# EAGLE design RatDBS (EAGLE 7.3.0)
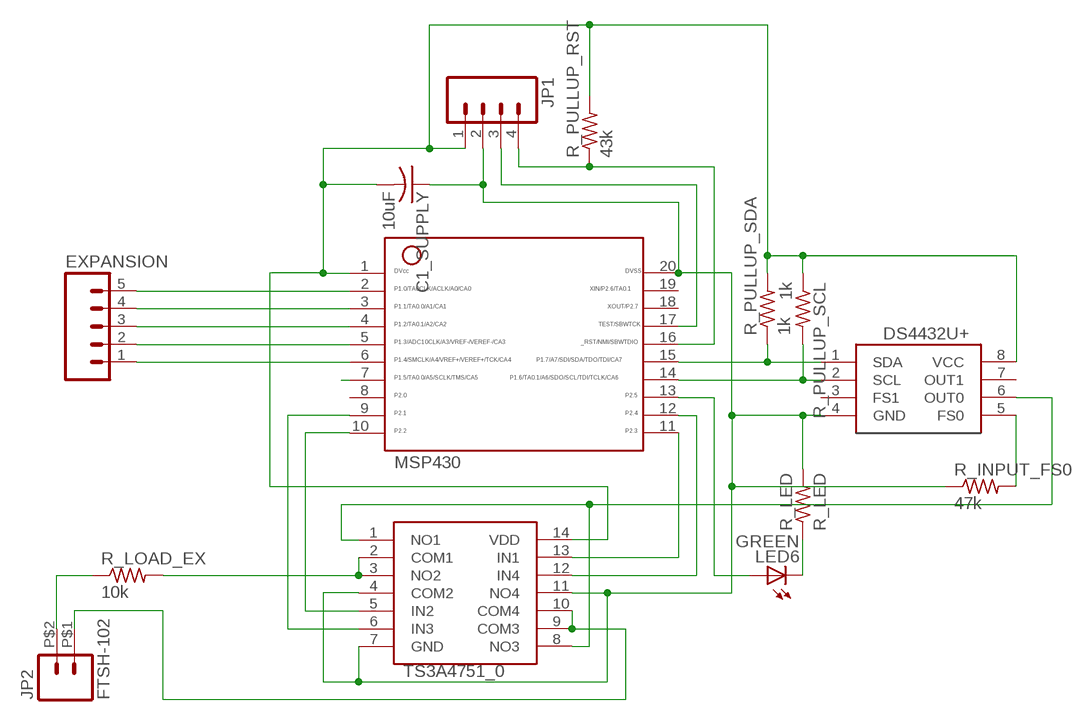
[diagram p0: schematic, sheet 1]

## Parts
C1_SUPPLY  10uF  C-USC0603  [C0603]
DS4432U+  DS4432U+  [8_PIN]
EXPANSION  M051.27MM  [1X05-1.27MM]
JP1  M041.27MM  [1X04-1.27MM]
JP2  FTSH-102  [FTSH-102-DH]
LED6  GREEN  LED1206  [LED-1206]
MSP430  MSP430  [20_PIN]
R_INPUT_FS0  47k  R-US_R0603  [R0603]
R_LED  R_LED  R-US_R0603  [R0603]
R_LOAD_EX  10k  R-US_R0603  [R0603]
R_PULLUP_RST  43k  R-US_R0603  [R0603]
R_PULLUP_SCL  1k  R-US_R0603  [R0603]
R_PULLUP_SDA  1k  R-US_R0603  [R0603]
TS3A4751_0  TS3A4751  [14_PIN]

## Nets
_RST: JP1.4 MSP430.16 R_PULLUP_RST.1
CURRENT0: DS4432U+.6(OUT0) TS3A4751_0.1(NO1) TS3A4751_0.8(NO3)
GND: C1_SUPPLY.1 DS4432U+.4(GND) JP1.2 MSP430.20 R_INPUT_FS0.1 R_LED.2 TS3A4751_0.4(COM2) TS3A4751_0.7(GND) TS3A4751_0.11(NO4)
IN1: MSP430.11 TS3A4751_0.13(IN1)
IN2_0: MSP430.10 TS3A4751_0.5(IN2)
IN3_0: MSP430.9 TS3A4751_0.6(IN3)
IN4: MSP430.12 TS3A4751_0.12(IN4)
LOAD1_0: R_LOAD_EX.2 TS3A4751_0.2(COM1) TS3A4751_0.3(NO2)
LOAD2_0: JP2.P$1 TS3A4751_0.9(COM3) TS3A4751_0.10(COM4)
N$1: DS4432U+.2(SCL) MSP430.14 R_PULLUP_SCL.2
N$2: DS4432U+.1(SDA) MSP430.15 R_PULLUP_SDA.1
N$3: EXPANSION.1 MSP430.6
N$4: JP2.P$2 R_LOAD_EX.1
N$5: LED6.A MSP430.13
N$6: MSP430.7
N$7: EXPANSION.2 MSP430.5
N$8: DS4432U+.5(FS0) R_INPUT_FS0.2
N$9: LED6.C R_LED.1
N$10: EXPANSION.3 MSP430.4
N$11: EXPANSION.4 MSP430.3
N$12: EXPANSION.5 MSP430.2
TEST: JP1.3 MSP430.17
VDD: C1_SUPPLY.2 DS4432U+.8(VCC) JP1.1 MSP430.1 R_PULLUP_RST.2 R_PULLUP_SCL.1 R_PULLUP_SDA.2 TS3A4751_0.14(VDD)
Unconnected: DS4432U+.3(FS1) DS4432U+.7(OUT1) MSP430.8 MSP430.18 MSP430.19

## Library data of the parts
C1_SUPPLY = resistor:C-US: CAPACITOR, American symbol
DS4432U+ = BiphasicBoard:DS4432U+: DS4432U+ current DAC
EXPANSION = SparkFun:M05: Header 5 Standard 5-pin 0.1" header. Use with straight break away headers (SKU : PRT-00116), right angle break away headers (PRT-00553), swiss pins (PRT-00743), machine pins (PRT-00117), and female headers (PRT-00115). Molex polarized connector foot print use with SKU : PRT-08230 with associated crimp pins and housings.
JP1 = SparkFun:M04: Header 4 Standard 4-pin 0.1" header. Use with straight break away headers (SKU : PRT-00116), right angle break away headers (PRT-00553), swiss pins (PRT-00743), machine pins (PRT-00117), and female headers (PRT-00115). Molex polarized connector foot print use with SKU : PRT-08231 with associated crimp pins and housings.
JP2 = Samtec50Mil:FTSH-102
LED6 = SparkFun-LED:LED: LEDs Standard schematic elements and footprints for 5mm, 3mm, 1206, and 0603 sized LEDs. 5mm - Spark Fun Electronics SKU : COM-00529 (and others)
MSP430 = BiphasicBoard:MSP430: MSP430 20 pins
R_INPUT_FS0 R_LED R_LOAD_EX R_PULLUP_RST R_PULLUP_SCL R_PULLUP_SDA = BiphasicBoard:R-US_: RESISTOR, American symbol
TS3A4751_0 = BiphasicBoard:TS3A4751: TS3A4751 Quad Switch

## Board
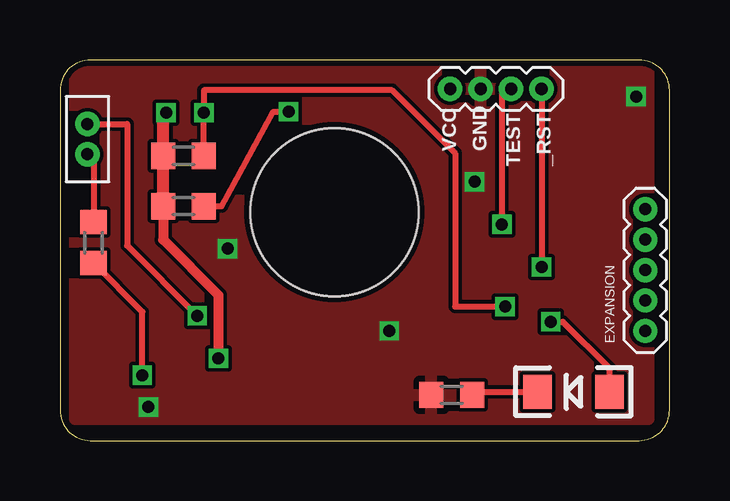
[diagram p1: board, top side]
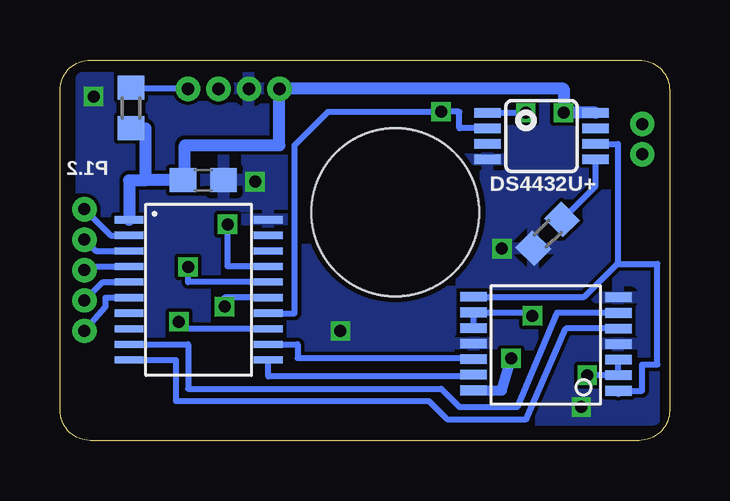
[diagram p2: board, bottom side, seen from below]

Size 25.4 x 15.88 mm. Coordinates in mm from the lower left corner, seen from the top.
Outline: 0,14.61 0,1.27 arc90 1.27,0 24.13,0 arc90 25.4,1.27 25.4,14.61 arc90 24.13,15.88 1.27,15.88 arc90 0,14.61
Copper layers (1*16): Top 0.035mm / dielectric 1.5mm / Bottom 0.035mm
Design rules "SeeedStudio_2layer_DRU_no_angle_20140221-1": minimum track width 6mil, minimum drill 12mil, track to track 6mil, track to pad 6mil, pad to pad 6mil, via to via 6mil, smd to smd 0mil, copper to edge 10mil, drill to drill 10mil, minimum pad ring 10mil, minimum via ring 6mil, stop-mask expansion 2mil, vias tented up to drill 100mil, thermal gap 10mil
Holes 7 mm at 11.43,9.53

### Footprints (pad centres in the part's own frame; a part is rotated, then mirrored left to right if it is on the bottom)
C0603 = smd 1.1 x 1: 1 -0.85,0; 2 0.85,0
8_PIN = smd 1.1 x 0.4: 1 -2.25,0.975; 2 -2.25,0.325; 3 -2.25,-0.325; 4 -2.25,-0.975; 5 2.25,-0.975; 6 2.25,-0.325; 7 2.25,0.325; 8 2.25,0.975
1X05-1.27MM = drill 0.508 pad 1: 1 0,0; 2 1.27,0; 3 2.54,0; 4 3.81,0; 5 5.08,0
1X04-1.27MM = drill 0.508 pad 1: 1 0,0; 2 1.27,0; 3 2.54,0; 4 3.81,0
FTSH-102-DH = drill 0.5 pad 1: P$1 -0.635,0; P$2 0.635,0
LED-1206 = smd 1.2 x 1.4: A -1.5,0; C 1.5,0
20_PIN = smd 0.3 x 1.2: 1 -2.925,-2.9; 2 -2.275,-2.9; 3 -1.625,-2.9; 4 -0.975,-2.9; 5 -0.325,-2.9; 6 0.325,-2.9; 7 0.975,-2.9; 8 1.625,-2.9; 9 2.275,-2.9; 10 2.925,-2.9; 11 2.925,2.9; 12 2.275,2.9; 13 1.625,2.9; 14 0.975,2.9; 15 0.325,2.9; 16 -0.325,2.9; 17 -0.975,2.9; 18 -1.625,2.9; 19 -2.275,2.9; 20 -2.925,2.9
R0603 = smd 1 x 1.1: 1 -0.85,0; 2 0.85,0
14_PIN = smd 1.1 x 0.4: 1 -3.26,1.165; 2 -3.26,0.515; 3 -3.26,-0.135; 4 -3.26,-0.785; 5 -3.26,-1.435; 6 -3.26,-2.085; 7 -3.26,-2.735; 8 2.77,-2.755; 9 2.77,-2.105; 10 2.77,-1.455; 11 2.77,-0.805; 12 2.77,-0.155; 13 2.77,0.495; 14 2.77,1.145

### Placement (x,y rotation side)
C1_SUPPLY  19.43,10.86 180 bottom
DS4432U+  5.33,12.7 0 bottom
EXPANSION  24.38,4.57 90 top
JP1  16.26,14.67 0 top
JP2  1.14,12.57 270 top
LED6  21.4,2.03 180 top
MSP430  19.62,6.29 270 bottom
R_INPUT_FS0  5.08,8.62 45 bottom
R_LED  16.32,1.91 180 top
R_LOAD_EX  1.4,8.26 270 top
R_PULLUP_RST  22.44,13.88 270 bottom
R_PULLUP_SCL  5.14,9.78 0 top
R_PULLUP_SDA  5.14,11.87 180 top
TS3A4751_0  5.4,3.24 180 bottom

### Tracks (layer width: path | path; a pad name or v marks a point on that pad's centre or on a via)
_RST  (via drill 0.5)
  Top 0.254: JP1.4 v20.07,7.24
  Bottom 0.254: MSP430.16 20.07,6.61 v20.07,7.24 | JP1.4 22.44,14.67 R_PULLUP_RST.1
CURRENT0
  Bottom 0.254: DS4432U+.6 2.16,12.38 2.16,7.37 | 2.16,7.37 0.51,7.37 0.51,3.17 1.14,3.17 1.14,2.07 TS3A4751_0.1 2.13,1.95 | TS3A4751_0.8 3.56,5.99 2.18,7.37 2.16,7.37
GND  (via drill 0.5)
  other vias: 13.72,4.57 17.27,10.79 24,14.35 3.68,1.4 6.99,8
  pour Top: 0.64,15.75 24.51,15.75 24.51,0.89 0.64,0.89
  pour Bottom: 0.64,15.11 24.51,15.11 24.51,0.89 0.64,0.89
IN1
  Bottom 0.254: MSP430.11 16.72,2.67 8.17,2.67 TS3A4751_0.13
IN2_0
  Bottom 0.254: MSP430.10 20.57,3.36 20.57,1.65 10.03,1.65 9.27,0.89 5.97,0.89 4.32,4.67 TS3A4751_0.5
IN3_0
  Bottom 0.254: MSP430.9 20.07,4.01 20.07,2.16 9.53,2.16 8.76,1.4 6.35,1.4 4.7,5.32 TS3A4751_0.6
IN4
  Bottom 0.254: MSP430.12 15.49,4.01 15.49,3.43 8.17,3.43 TS3A4751_0.12
LOAD1_0  (via drill 0.5)
  Top 0.254: v3.43,2.72 3.43,5.37 R_LOAD_EX.2
  Bottom 0.254: TS3A4751_0.3 TS3A4751_0.2 v3.43,2.72
LOAD2_0  (via drill 0.5)
  Top 0.254: JP2.P$1 2.79,13.21 2.79,8.13 v5.71,5.21
  Bottom 0.254: TS3A4751_0.10 TS3A4751_0.9 5.71,5.34 v5.71,5.21
N$1  (via drill 0.5)
  Top 0.254: R_PULLUP_SCL.2 6.73,9.78 8.89,13.72 v9.53,13.72
  Bottom 0.254: MSP430.14 15.62,5.31 15.62,12.32 14.22,13.72 v9.53,13.72 8.76,13.72 8.76,13.03 DS4432U+.2
N$2  (via drill 0.5)
  Top 0.254: v18.54,5.59 16.47,5.59 16.47,11.98 13.84,14.61 5.99,14.61 v5.99,13.68 R_PULLUP_SDA.1
  Bottom 0.254: DS4432U+.1 v5.99,13.68 | MSP430.15 18.54,5.96 v18.54,5.59
N$3
  Bottom 0.254: EXPANSION.1 23.5,5.59 23.5,5.96 MSP430.6
N$4
  Top 0.254: R_LOAD_EX.1 1.4,11.94 JP2.P$2
N$5  (via drill 0.5)
  Top 0.254: LED6.A 22.9,3.01 20.95,4.95 v20.45,4.95
  Bottom 0.254: MSP430.13 20.45,4.66 v20.45,4.95
N$7
  Bottom 0.254: EXPANSION.2 23.61,6.61 MSP430.5
N$8
  Bottom 0.254: R_INPUT_FS0.2 3.08,10.62 DS4432U+.5
N$9
  Top 0.254: R_LED.1 17.3,2.03 LED6.C
N$10
  Bottom 0.254: EXPANSION.3 24.23,7.26 MSP430.4
N$11
  Bottom 0.254: EXPANSION.4 23.91,7.91 MSP430.3
N$12
  Bottom 0.254: EXPANSION.5 23.29,8.56 MSP430.2
TEST  (via drill 0.5)
  Top 0.254: JP1.3 18.41,14.67 v18.41,9.02
  Bottom 0.254: MSP430.17 18.41,7.26 v18.41,9.02
VDD  (via drill 0.5)
  Top 0.406: v6.6,3.43 6.6,6.07 4.29,8.38 R_PULLUP_SCL.1
  Top 0.508: R_PULLUP_SCL.1 R_PULLUP_SDA.2 4.29,13.68 v4.42,13.68
  Bottom 0.406: TS3A4751_0.14 6.99,2.09 v6.6,3.43
  Bottom 0.508: 21.84,10.86 C1_SUPPLY.2 20.19,10.86 20.19,12.32 16.26,12.32 JP1.1 4.42,14.67 v4.42,13.68 DS4432U+.8 | MSP430.1 22.52,10.86 21.84,10.86 | R_PULLUP_RST.2 21.84,13.03 21.84,10.86

### Text on the board
tNames: VCC | GND | TEST | _RST
bNames: P1.2
tDocu: Biphasic v2.0 / Kemere Lab 2015